# Altium schematic sheet l-link-ob-sam3u-bga.SchDoc: J-Link-OB-SAM3U TFBGA100
size A3; Revision: 2.0.0; SheetNumber: 2; SheetTotal: 3; DrawnBy: RUBR; ProjectNumber: 4393; PCAName: PCA10000; PCBRevision: 0100RUBR; DocumentSize: A2; PCBNumber: 400003; ProjectName: Echelon
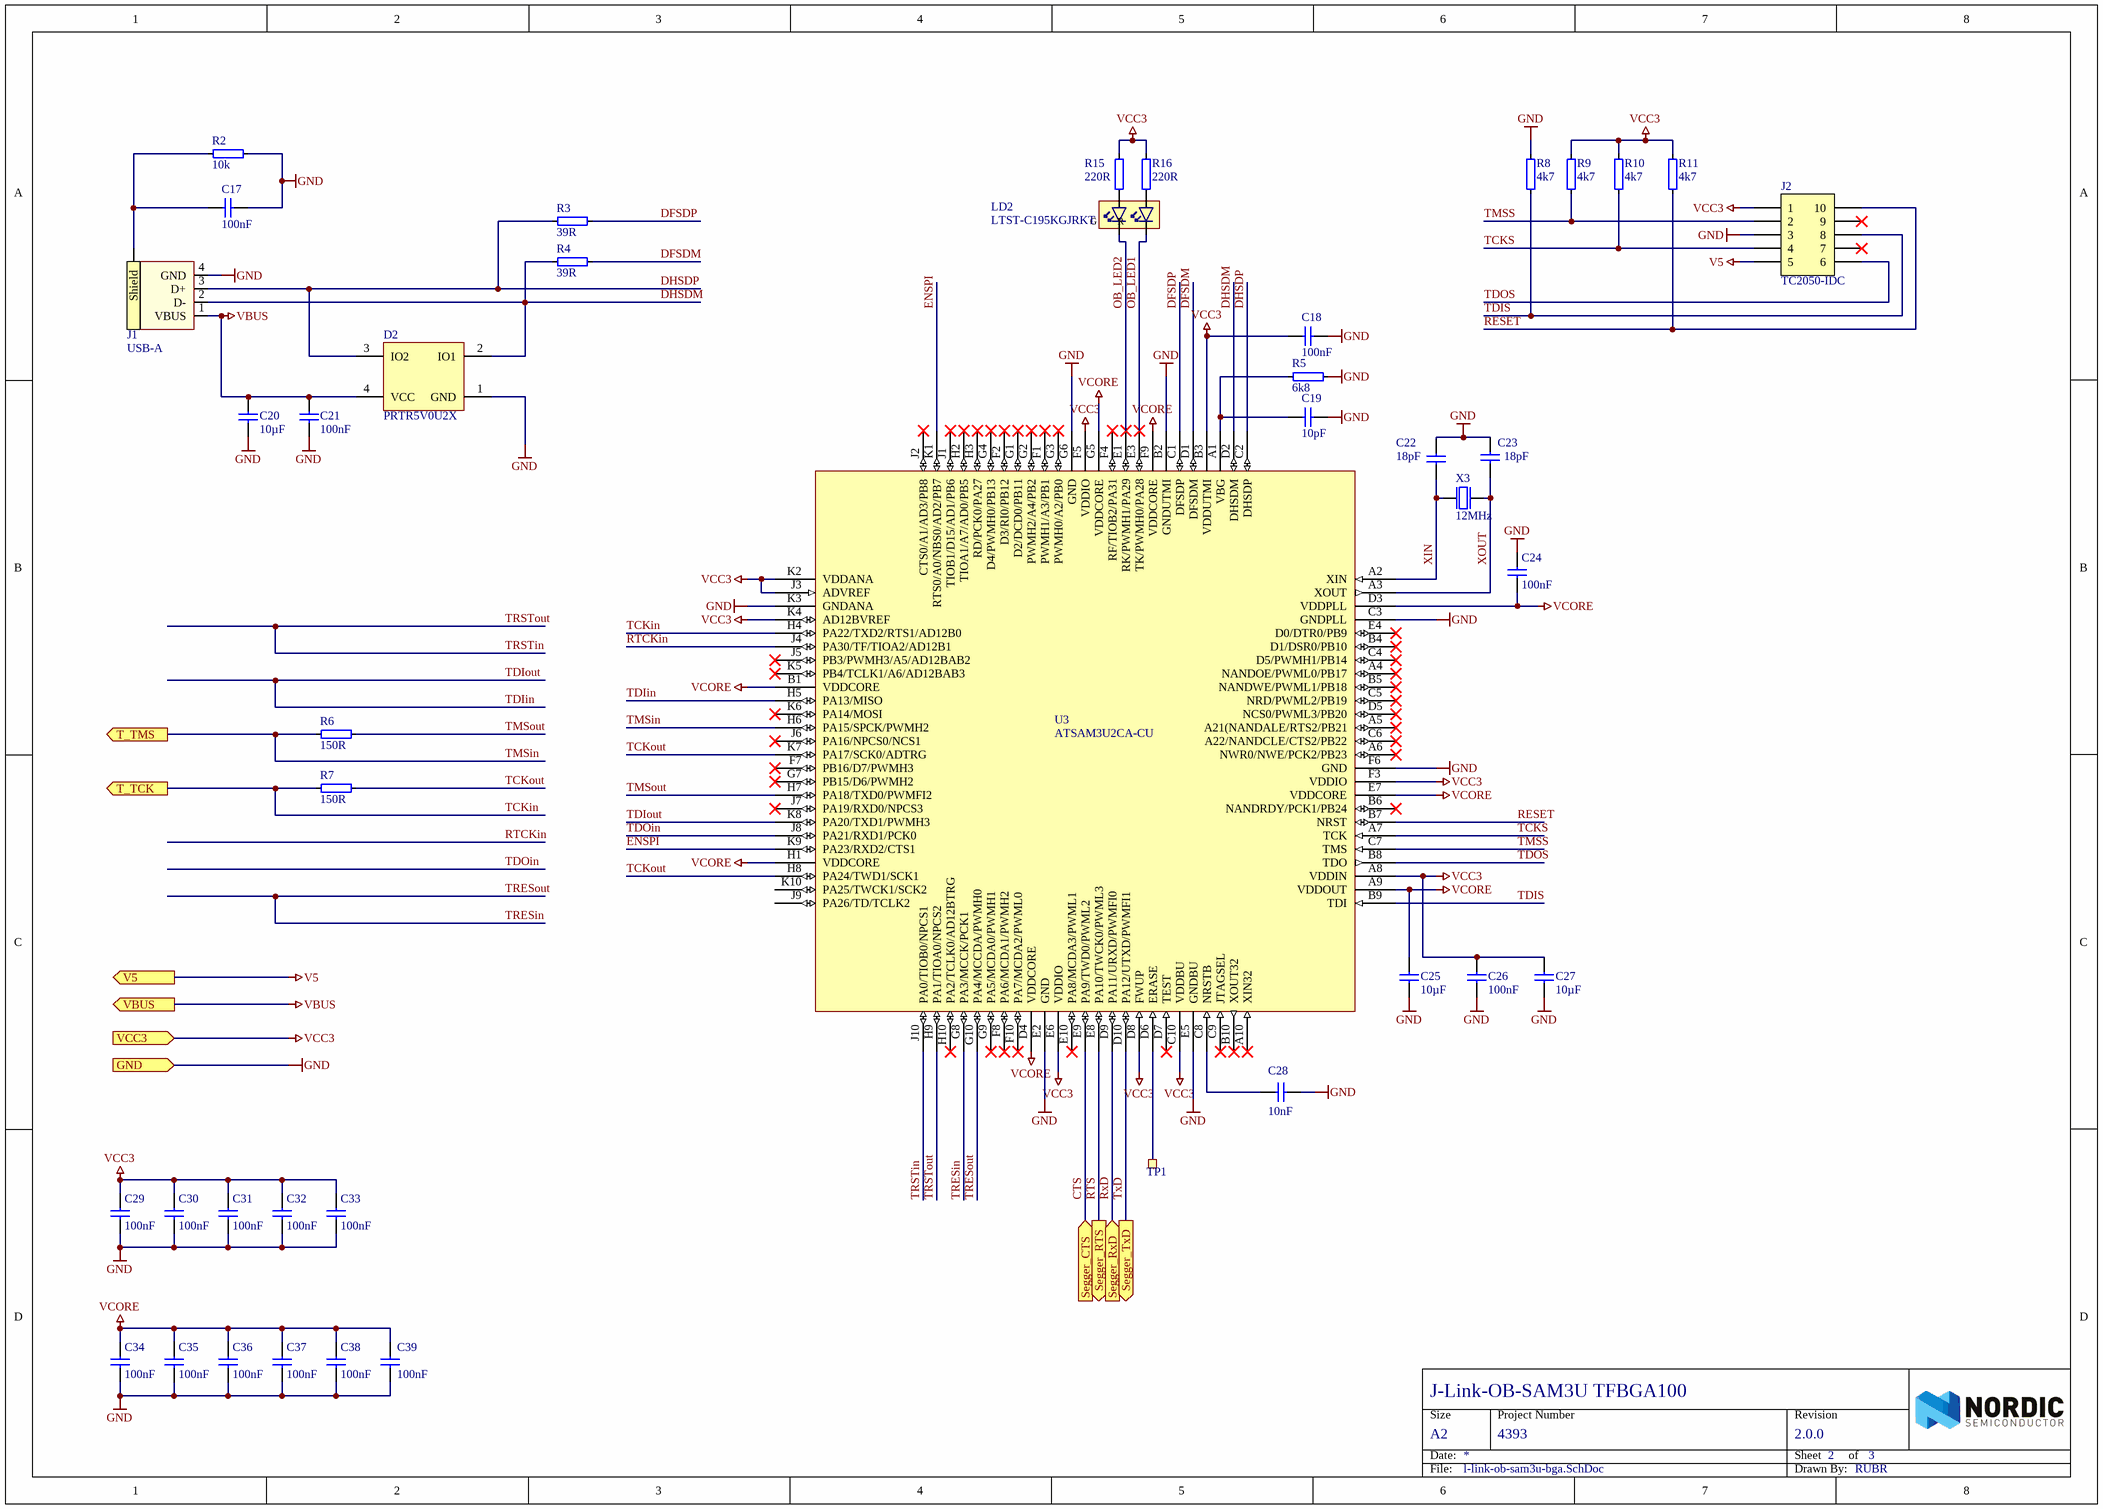
[diagram p0: l-link-ob-sam3u-bga.SchDoc]

## Parts
C17  100nF  [CAPC1005X04L]
C18  100nF  [CAPC1005X04L]
C19  10pF  [CAPC1005X04L]
C20  10µF  [CAPC1608X06L]
C21  100nF  [CAPC1005X04L]
C22  18pF  [CAPC1005X04L]
C23  18pF  [CAPC1005X04L]
C24  100nF  [CAPC1005X04L]
C25  10µF  [CAPC1608X06L]
C26  100nF  [CAPC1005X04L]
C27  10µF  [CAPC1608X06L]
C28  10nF  [CAPC1005X04L]
C29  100nF  [CAPC1005X04L]
C30  100nF  [CAPC1005X04L]
C31  100nF  [CAPC1005X04L]
C32  100nF  [CAPC1005X04L]
C33  100nF  [CAPC1005X04L]
C34  100nF  [CAPC1005X04L]
C35  100nF  [CAPC1005X04L]
C36  100nF  [CAPC1005X04L]
C37  100nF  [CAPC1005X04L]
C38  100nF  [CAPC1005X04L]
C39  100nF  [CAPC1005X04L]
D2  PRTR5V0U2X  [SOT190P230X110-4L]
J1  USB-A  [USB-PCB-A-SMD]
J2  TC2050-IDC  [TC2050-IDC-NLFP]  (no BOM)
LD2  LTST-C195KGJRKT  [LED_DUAL_0606]
R2  10k  [RESC1005X04L]
R3  39R  [RESC1005X04L]
R4  39R  [RESC1005X04L]
R5  6k8  [RESC1005X04L]
R6  150R  [RESC1005X04L]
R7  150R  [RESC1005X04L]
R8  4k7  [RESC1005X04L]
R9  4k7  [RESC1005X04L]
R10  4k7  [RESC1005X04L]
R11  4k7  [RESC1005X04L]
R15  220R  [RESC1005X04L]
R16  220R  [RESC1005X04L]
TP1  1.0mm,SMD  [TP_SMD_1.0mmX1.0mm]  (value not drawn)  (no BOM)
U3  ATSAM3U2CA-CU  [BGA100C80P10X10_900X900X110]
X3  12MHz  [BT-XTAL_3225]

## Ports
GND (in), Segger_CTS (in), Segger_RTS (out), Segger_RxD (in), Segger_TxD (out), T_TCK (out), T_TMS (out), V5 (out), VBUS (out), VCC3 (in)

## Nets
GND: C17.1 C18.1 C19.1 C20.1 C21.1 C22.2 C23.2 C24.2 C25.1 C26.1 C27.1 C28.1 C29.1 C30.1 C31.1 C32.1 C33.1 C34.1 C35.1 C36.1 C37.1 C38.1 C39.1 D2.1(GND) J1.4(GND) J2.3 R2.1 R5.1 R8.2 U3.B2(GNDUTMI) U3.C3(GNDPLL) U3.E2(GND) U3.E5(GNDBU) U3.F6(GND) U3.G6(GND) U3.K3(GNDANA) X3.2(GND) X3.4(GND) ; port GND
V5: J2.5 ; port V5
VBUS: C20.2 C21.2 D2.4(VCC) J1.1(VBUS) ; port VBUS
VCC3: C18.2 C26.2 C27.2 C29.2 C30.2 C31.2 C32.2 C33.2 J2.1 R9.2 R10.2 R11.2 R15.1 R16.1 U3.A8(VDDIN) U3.B3(VDDUTMI) U3.C10(VDDBU) U3.D8(FWUP) U3.E6(VDDIO) U3.F3(VDDIO) U3.F5(VDDIO) U3.J3(ADVREF) U3.K2(VDDANA) U3.K4(AD12BVREF) ; port VCC3
VCORE: C24.1 C25.2 C34.2 C35.2 C36.2 C37.2 C38.2 C39.2 U3.A9(VDDOUT) U3.B1(VDDCORE) U3.D3(VDDPLL) U3.D4(VDDCORE) U3.E7(VDDCORE) U3.F9(VDDCORE) U3.G5(VDDCORE) U3.H1(VDDCORE)
CTS: U3.E9(PA9/TWD0/PWML2) ; port Segger_CTS
DFSDM: R4.1 U3.D1(DFSDM)
DFSDP: R3.1 U3.C1(DFSDP)
DHSDM: D2.2(IO1) J1.2(D-) R4.2 U3.D2(DHSDM)
DHSDP: D2.3(IO2) J1.3(D+) R3.2 U3.C2(DHSDP)
ENSPI: U3.K1(RTS0/A0/NBS0/AD2/PB7) U3.K9(PA23/RXD2/CTS1)
OB_LED1: LD2.4(C1) U3.E3(TK/PWMH0/PA28)
OB_LED2: LD2.3(C2) U3.E1(RK/PWMH1/PA29)
RESET: J2.10 R11.1 U3.B7(NRST)
RTCKin: U3.J4(PA30/TF/TIOA2/AD12B1)
RTS: U3.E8(PA10/TWCK0/PWML3) ; port Segger_RTS
RxD: U3.D9(PA11/URXD/PWMFI0) ; port Segger_RxD
TCKin: R7.2 U3.H4(PA22/TXD2/RTS1/AD12B0) ; port T_TCK
TCKout: R7.1 U3.H8(PA24/TWD1/SCK1) U3.K7(PA17/SCK0/ADTRG)
TCKS: J2.4 R10.1 U3.A7(TCK)
TDIin: U3.H5(PA13/MISO) U3.K8(PA20/TXD1/PWMH3)  [also labelled TDIout]
TDIS: J2.8 R8.1 U3.B9(TDI)
TDOin: U3.J8(PA21/RXD1/PCK0)
TDOS: J2.6 U3.B8(TDO)
TMSin: R6.2 U3.H6(PA15/SPCK/PWMH2) ; port T_TMS
TMSout: R6.1 U3.H7(PA18/TXD0/PWMFI2)
TMSS: J2.2 R9.1 U3.C7(TMS)
TRESin: U3.G8(PA3/MCCK/PCK1) U3.G10(PA4/MCCDA/PWMH0)  [also labelled TRESout]
TRSTin: U3.H9(PA1/TIOA0/NPCS2) U3.J10(PA0/TIOB0/NPCS1)  [also labelled TRSTout]
TxD: U3.D10(PA12/UTXD/PWMFI1) ; port Segger_TxD
XIN: C22.1 U3.A2(XIN) X3.1(inp)
XOUT: C23.1 U3.A3(XOUT) X3.3(out)
NetC17_2: C17.2 J1.0(Shield) R2.2
NetC19_2: C19.2 R5.2 U3.A1(VBG)
NetC28_2: C28.2 U3.C8(NRSTB)
NetLD2_1: LD2.1(A2) R15.2
NetLD2_2: LD2.2(A1) R16.2
NetTP1_1: TP1.1 U3.D6(ERASE)

Not connected (* = marked no-connect by the designer): J2 7* 9*; U3 A4(NANDOE/PWML0/PB17)* A5(A21(NANDALE/RTS2/PB21)* A6(NWR0/NWE/PCK2/PB23)* A10(XIN32)* B4(D1/DSR0/PB10)* B5(NANDWE/PWML1/PB18)* B6(NANDRDY/PCK1/PB24)* B10(XOUT32)* C4(D5/PWMH1/PB14)* C5(NRD/PWML2/PB19)* C6(A22/NANDCLE/CTS2/PB22)* C9(JTAGSEL)* D5(NCS0/PWML3/PB20)* D7(TEST)* E4(D0/DTR0/PB9)* E10(PA8/MCDA3/PWML1)* F1(PWMH1/A3/PB1)* F2(D3/RI0/PB12)* F4(RF/TIOB2/PA31)* F7(PB16/D7/PWMH3)* F8(PA6/MCDA1/PWMH2)* F10(PA7/MCDA2/PWML0)* G1(D2/DCD0/PB11)* G2(PWMH2/A4/PB2)* G3(PWMH0/A2/PB0)* G4(D4/PWMH0/PB13)* G7(PB15/D6/PWMH2)* G9(PA5/MCDA0/PWMH1)* H2(TIOA1/A7/AD0/PB5)* H3(RD/PCK0/PA27)* H10(PA2/TCLK0/AD12BTRG)* J1(TIOB1/D15/AD1/PB6)* J2(CTS0/A1/AD3/PB8)* J5(PB3/PWMH3/A5/AD12BAB2)* J6(PA16/NPCS0/NCS1)* J7(PA19/RXD0/NPCS3)* J9(PA26/TD/TCLK2) K5(PB4/TCLK1/A6/AD12BAB3)* K6(PA14/MOSI)* K10(PA25/TWCK1/SCK2)

## Notes on the sheet
- Size
- Date:
- Project Number
- Sheet         of
- Revision
- File:
- Drawn By:
- (in symbol LTST-C195KGJRKT) G; R

## Library data of the parts
C17 C18 C21 C24 C26 C29-C39 = C0402-100n: Capacitor, X7R, ±10%; Note: 16V; Artikkelnr Noca: 20039200; Part Number: C0402-100n; Manufacturer: *; Manufacturer Part Number: *; Datasheet: *; Footprint: 0402; LatestRevisionDate: 2009-11-23; Pin Count: 2; Publisher: Nordic Semiconductor; Published: 2009-05-08; Value: 100nF; Supplier: *; Supplier part number: *; 2nd source Supplier: *; 2nd source part number: *
C19 = C0402-10p: Capacitor, NP0, ±2%; 2nd source part number: 185-6064; Note: 50V; Artikkelnr Noca: 20029260; Part Number: C0402-10p; Manufacturer: *; Manufacturer Part Number: *; Datasheet: *; Footprint: 0402; LatestRevisionDate: 2009-05-08; Pin Count: 2; Publisher: Nordic Semiconductor; Published: 2009-05-08; Value: 10pF; Supplier: Digi-Key; Supplier part number: 712-1252-1-ND; 2nd source Supplier: Farnell
C20 C25 C27 = C0603-10µ: Capacitor, X5R, ±10%; Note: 6.3V; Artikkelnr Noca: 20039252; Part Number: C0603-10µ; Manufacturer: *; Manufacturer Part Number: *; Datasheet: *; Footprint: 0603; LatestRevisionDate: 2011-01-17; Pin Count: 2; Publisher: Nordic Semiconductor; Published: 2011-01-17; Value: 10µF; Supplier: *; Supplier part number: *; 2nd source Supplier: *; 2nd source part number: *
C22 C23 = C0402-18p: Capacitor, NP0, ±5%; Note: 50V; Artikkelnr Noca: 20029209; Part Number: C0402-18p; Manufacturer: *; Manufacturer Part Number: *; Datasheet: *; Footprint: 0402; LatestRevisionDate: 2009-05-08; Pin Count: 2; Publisher: Nordic Semiconductor; Published: 2009-05-08; Value: 18pF; Supplier: *; Supplier part number: *; 2nd source Supplier: *; 2nd source part number: *
C28 = C0402-10n: Capacitor, X7R, ±10%; Note: 16V; Artikkelnr Noca: 20039166; Part Number: C0402-10n; Manufacturer: *; Manufacturer Part Number: *; Datasheet: *; Footprint: 0402; LatestRevisionDate: 2009-11-23; Pin Count: 2; Publisher: Nordic Semiconductor; Published: 2009-05-08; Value: 10nF; Supplier: *; Supplier part number: *; 2nd source Supplier: *; 2nd source part number: *
D2 = PRTR5V0U2X: Ultra low capacitance double rail-to-rail ESD protection diode; Manufacturer: NXP; 2nd source part number: 152-4157; Artikkelnr Noca: 10069015; Part Number: PRTR5V0U2X; Manufacturer Part Number: PRTR5V0U2X; Datasheet: http://www.farnell.com/datasheets/109718.pdf; Footprint: SOT-143B; LatestRevisionDate: 2012-06-11; Publisher: Nordic Semiconductor; Published: 2012-06-11; Value: PRTR5V0U2X; Note: *; Supplier: Digi-Key; Supplier part number: 568-4140-1-ND; 2nd source Supplier: Farnell
J1 = Molex USB-A-SMT_w/shield: Molex USB-A-SMT; Manufacturer Part Number: 48037-1000; 2nd source part number: 538-48037-1000; Note: MOLEX - 48037-1000; Artikkelnr Noca: 55079008; Value: USB-A; Part Number: Molex USB-A-SMT_w/shield; Manufacturer: Molex; Datasheet: http://www.molex.com/pdm_docs/sd/480371000_sd.pdf; LatestRevisionDate: 2012-11-21; Publisher: Nordic Semiconductor; Published: 2012-11-21; Supplier: Digi-Key; Supplier part number: WM17118-ND; 2nd source Supplier: Mouser
J2 = TC2050-IDC-NLFP: CBL PLUG-OF-NAILS 10-PIN; Manufacturer: Tag-Connect LLC; Artikkelnr Noca: N.A.; Part Number: TC2050-IDC-NLFP; Manufacturer Part Number: TC2050-IDC-NLFP; Datasheet: http://www.tag-connect.com/Materials/TC2050-IDC%20Datasheet.pdf; LatestRevisionDate: 2012-11-21; Publisher: Nordic Semiconductor; Published: 2012-11-21; Value: TC2050-IDC; Supplier: Digi-Key; Supplier part number: TC2050-IDC-NL-ND; 2nd source Supplier: *; 2nd source part number: *
LD2 = LTST-C195KGJRKT: Avago, HSMF-A203 Bi-Color LED; Manufacturer: Lite-On Inc; 2nd source part number: 859-LTST-C195KGJRKT; Note: HSMF-A203- xxxxx GaP Red GaP Emerald Green; Artikkelnr Noca: 13019145; Part Number: LTST-C195KGJRKT; Manufacturer Part Number: LTST-C195KGJRKT; Datasheet: http://media.digikey.com/pdf/Data%20Sheets/Lite-On%20PDFs/LTST-C195KGJRKT.pdf; LatestRevisionDate: 2012-07-05; Pin Count: 4; Publisher: Nordic Semiconductor; Published: 2012-07-05; Value: LTST-C195KGJRKT; Supplier: Digi-Key; Supplier part number: 160-1452-1-ND; 2nd source Supplier: Mouser
R2 = R0402-10k: Resistor, ±1%, 0.063W; Note: Chip Res 1%; Artikkelnr Noca: 27049097; Value: 10k; Part Number: R0402-10k; Manufacturer: *; Manufacturer Part Number: *; Datasheet: *; Footprint: 0402; LatestRevisionDate: 2009-11-23; Pin Count: 2; Publisher: Nordic Semiconductor; Published: 2009-05-08; Supplier: Farnell; Supplier part number: 173-8864; 2nd source Supplier: *; 2nd source part number: *
R3 R4 = R0402-39R: Resistor, ±1%, 0.063W; Note: Chip Res 1%; Artikkelnr Noca: 27049039; Value: 39R; Part Number: R0402-39R; Manufacturer: *; Manufacturer Part Number: *; Datasheet: *; Footprint: 0402; LatestRevisionDate: 2009-11-23; Pin Count: 2; Publisher: Nordic Semiconductor; Published: 2009-05-08; Supplier: Farnell; Supplier part number: 173-8831; 2nd source Supplier: *; 2nd source part number: *
R5 = R0402-6k8: Resistor, ±1%, 0.063W; Note: Chip Res 1%; Artikkelnr Noca: 27049093; Part Number: R0402-6k8; Manufacturer: *; Manufacturer Part Number: *; Datasheet: *; Footprint: 0402; LatestRevisionDate: 2009-11-23; Pin Count: 2; Publisher: Nordic Semiconductor; Published: 2009-05-08; Value: 6k8; Supplier: Farnell; Supplier part number: 173-8862; 2nd source Supplier: *; 2nd source part number: *
R6 R7 = R0402-150: Resistor, ±1%, 0.063W; Note: Chip Res 1%; Artikkelnr Noca: 27049053; Part Number: R0402-150; Manufacturer: *; Manufacturer Part Number: *; Datasheet: *; Footprint: 0402; LatestRevisionDate: 2009-11-23; Pin Count: 2; Publisher: Nordic Semiconductor; Published: 2009-05-08; Value: 150R; Supplier: Farnell; Supplier part number: 173-8839; 2nd source Supplier: *; 2nd source part number: *
R8-R11 = R0402-4k7: Resistor, ±1%, 0.063W; Note: Chip Res 1%; Artikkelnr Noca: 27049089; Part Number: R0402-4k7; Manufacturer: *; Manufacturer Part Number: *; Datasheet: *; Footprint: 0402; LatestRevisionDate: 2009-11-23; Pin Count: 2; Publisher: Nordic Semiconductor; Published: 2009-05-08; Value: 4k7; Supplier: Farnell; Supplier part number: 173-8858; 2nd source Supplier: *; 2nd source part number: *
R15 R16 = R0402-220: Resistor, ±1%, 0.063W; Note: Chip Res 1%; Artikkelnr Noca: 27049057; Part Number: R0402-220; Manufacturer: *; Manufacturer Part Number: *; Datasheet: *; Footprint: 0402; LatestRevisionDate: 2009-11-23; Pin Count: 2; Publisher: Nordic Semiconductor; Published: 2009-05-08; Value: 220R; Supplier: Farnell; Supplier part number: 173-8841; 2nd source Supplier: *; 2nd source part number: *
TP1 = TP_SMD_1.0MM: Regular Plated, 1.0mm hole; Manufacturer: Nordic Semiconductor; Artikkelnr Noca: N.A.; Part Number: TP_SMD_1.0MM; Manufacturer Part Number: *; Datasheet: *; LatestRevisionDate: 2009-12-12; Pin Count: 1; Publisher: Nordic Semiconductor; Published: 2009-12-12; Value: 1.0mm,SMD; Note: Regular Plated, 1.0mm hole; Supplier: *; Supplier part number: *; 2nd source Supplier: *; 2nd source part number: *
U3 = ATSAM3U2CA-CU: IC MCU 32bit 128kB flash 100TFBGA; Manufacturer: Atmel; 2nd source part number: 556-ATSAM3U2CA-CU; Artikkelnr Noca: 15019072; Part Number: ATSAM3U2CA-CU; Manufacturer Part Number: ATSAM3U2CA-CU; Datasheet: http://www.atmel.com/Images/6430s.pdf; Footprint: TFBGA100; LatestRevisionDate: 2012-06-01; Pin Count: 100; Publisher: Nordic Semiconductor; Published: 2012-06-01; Value: ATSAM3U2CA-CU; Note: *; Supplier: Digi-Key; Supplier part number: ATSAM3U2CA-CU-ND; 2nd source Supplier: Mouser
X3 = XTAL SMD 12MHz (3225): XTAL SMD 3225, 12MHz, 18pF, ±30ppm; Manufacturer: TXC Corporation; Manufacturer Part Number: 7M-12.000MAAJ-T; 2nd source part number: 184-2056; Note: XTAL SMD 12.000MHz; Artikkelnr Noca: 22019166; Part Number: XTAL SMD 12MHz (3225); Datasheet: http://www.txccrystal.com/images/pdf/7m.pdf; LatestRevisionDate: 2010-08-31; Pin Count: 4; Publisher: Nordic Semiconductor; Published: 2010-08-31; Value: 12MHz; Supplier: Digi-Key; Supplier part number: 887-1121-1-ND; 2nd source Supplier: Farnell